# Altium schematic sheet AMS_Audio.SchDoc
size A
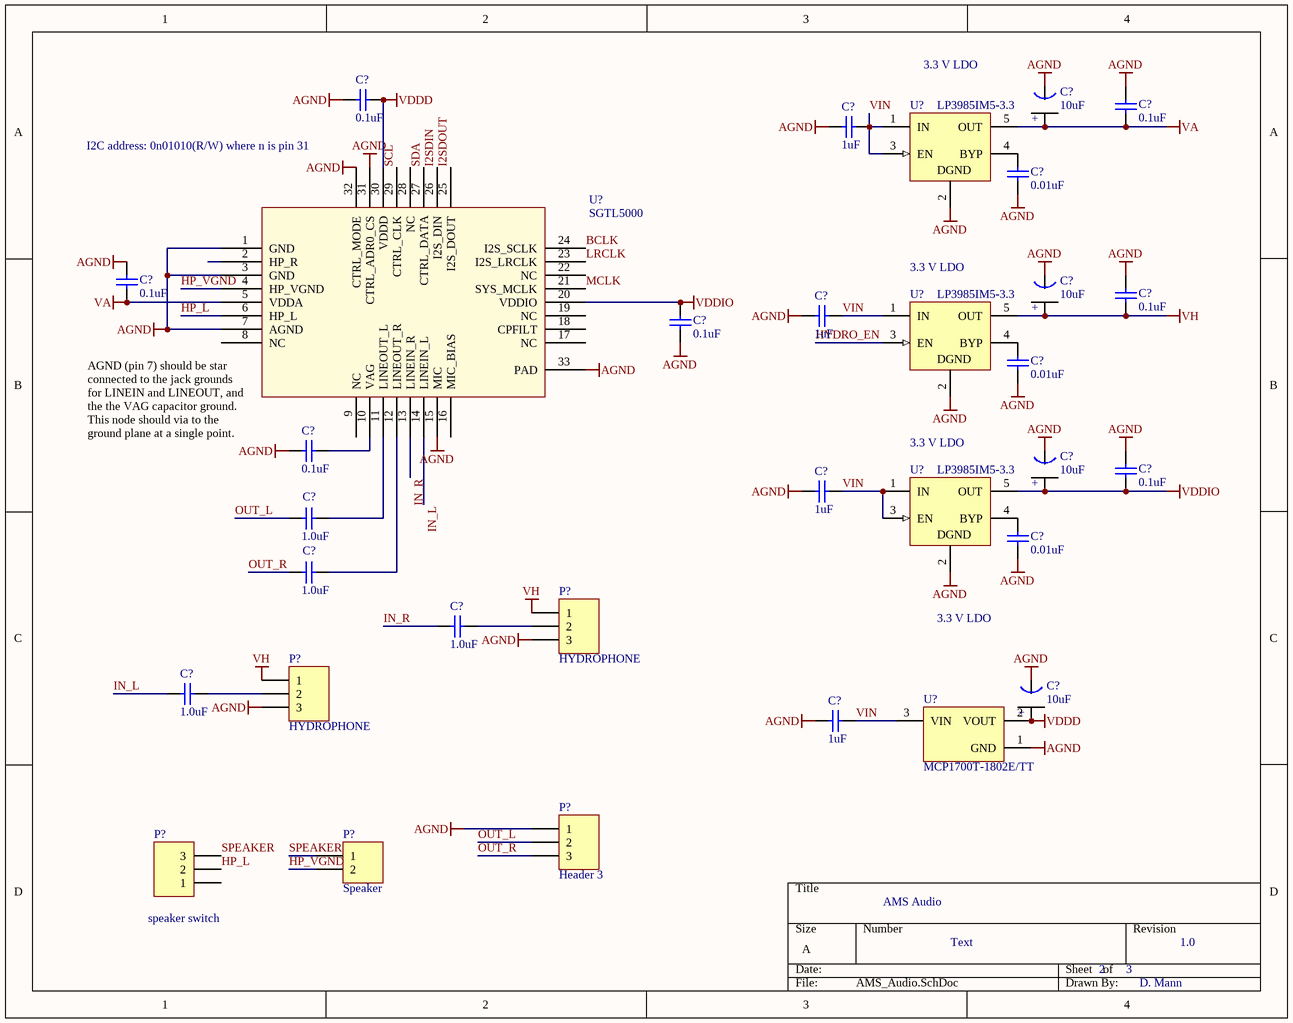
[diagram p0: AMS_Audio.SchDoc]

## Parts
(Parts that share a designator on the sheet are numbered #1, #2 ... from top to bottom, then left to right.)
C?#1  0.1uF  [0402]
C?#2  0.1uF  [0402]
C?#3  10uF  [Tant0805]
C?#4  1uF  [0402]
C?#5  0.01uF  [0402]
C?#6  0.1uF  [0402]
C?#7  0.1uF  [0402]
C?#8  10uF  [Tant0805]
C?#9  0.1uF  [0402]
C?#10  1uF  [0402]
C?#11  0.01uF  [0402]
C?#12  0.1uF  [0402]
C?#13  0.1uF  [0402]
C?#14  10uF  [Tant0805]
C?#15  1.0uF  [0402]
C?#16  1uF  [0402]
C?#17  0.01uF  [0402]
C?#18  1.0uF  [0402]
C?#19  1.0uF  [0402]
C?#20  1.0uF  [0402]
C?#21  10uF  [Tant0805]
C?#22  1uF  [0402]
P?#1  HYDROPHONE  [HDR1X3]
P?#2  HYDROPHONE  [HDR1X3]
P?#3  Header 3  [HDR1X3]
P?#4  Speaker  [HDR1X2]
P?#5  speaker switch  [HDR1X3]
U?#1  LP3985IM5-3.3  [MF05A_N]
U?#2  SGTL5000  [QFN32]
U?#3  LP3985IM5-3.3  [MF05A_N]
U?#4  LP3985IM5-3.3  [MF05A_N]
U?#5  MCP1700T-1802E/TT  [SOT-23-TT3_N]

## Nets
AGND: C?#1.2 C?#2.2 C?#3.1(GND) C?#4.2 C?#5.2 C?#6.2 C?#7.2 C?#8.1(GND) C?#9.2 C?#10.2 C?#11.2 C?#12.2 C?#13.2 C?#14.1(GND) C?#16.2 C?#17.2 C?#21.1(GND) C?#22.2 P?#1.3 P?#2.3 P?#3.1 U?#1.2(GND) U?#2.1(GND) U?#2.3(GND) U?#2.7(AGND) U?#2.15(MIC) U?#2.31(CTRL_ADR0_CS) U?#2.32(CTRL_MODE) U?#2.33(PAD) U?#3.2(GND) U?#4.2(GND) U?#5.1(GND)
VA: C?#2.1 C?#3.2(+) C?#6.1 U?#1.5(OUT) U?#2.5(VDDA)
VDDD: C?#1.1 C?#21.2(+) U?#2.30(VDDD) U?#5.2(VOUT)
VDDIO: C?#9.1 C?#13.1 C?#14.2(+) U?#2.20(VDDIO) U?#4.5(OUT)
VH: C?#7.1 C?#8.2(+) P?#1.1 P?#2.1 U?#3.5(OUT)
BCLK: U?#2.24(I2S_SCLK)
HP_L: P?#5.2 U?#2.6(HP_L)
HP_VGND: P?#4.2 U?#2.4(HP_VGND)
HYDRO_EN: U?#3.3(EN)
I2SDIN: U?#2.26(I2S_DIN)
I2SDOUT: U?#2.25(I2S_DOUT)
IN_L: C?#20.2 U?#2.14(LINEIN_L)
IN_R: C?#19.2 U?#2.13(LINEIN_R)
LRCLK: U?#2.23(I2S_LRCLK)
MCLK: U?#2.21(SYS_MCLK)
OUT_L: C?#15.1 P?#3.2
OUT_R: C?#18.1 P?#3.3
SCL: U?#2.29(CTRL_CLK)
SDA: U?#2.27(CTRL_DATA)
SPEAKER: P?#4.1 P?#5.3
VIN: C?#4.1 C?#10.1 C?#16.1 C?#22.1 U?#1.1(IN) U?#1.3(EN) U?#3.1(IN) U?#4.1(IN) U?#4.3(EN) U?#5.3(VIN)
NetC?#5_1: C?#5.1 U?#1.4(BYP)
NetC?#11_1: C?#11.1 U?#3.4(BYP)
NetC?#12_1: C?#12.1 U?#2.10(VAG)
NetC?#15_2: C?#15.2 U?#2.11(LINEOUT_L)
NetC?#17_1: C?#17.1 U?#4.4(BYP)
NetC?#18_2: C?#18.2 U?#2.12(LINEOUT_R)
NetC?#19_1: C?#19.1 P?#1.2
NetC?#20_1: C?#20.1 P?#2.2

Not connected (* = marked no-connect by the designer): P?#5 1; U?#2 2(HP_R) 8(NC) 9(NC) 16(MIC_BIAS) 17(NC) 18(CPFILT) 19(NC) 22(NC) 28(NC)

## Notes on the sheet
- 3.3 V LDO
- I2C address: 0n01010(R/W) where n is pin 31
- (near U?#3) 3.3 V LDO
- (near U?#2) AGND (pin 7) should be star connected to the jack grounds for LINEIN and LINEOUT, and the the VAG capacitor ground. This node should via to the ground plane at a single point.
- (near U?#4) 3.3 V LDO
- AMS Audio
- Text
- 2
- 3
- 1.0
- D. Mann
- (in symbol LP3985IM5-3.3) DGND

## Library data of the parts
C?#1 C?#2 C?#6 C?#7 C?#9 C?#12 C?#13 = C0402: Ceramic Chip Capacitor - Standard; Note: Footprint corresponds to dimensions for bulk cassette packaging. This case size has tightened tolerances.; Published: 17-Jul-2002; LatestRevisionDate: 19-Mar-2004; LatestRevisionNote: Silkscreen size reduced.; DatasheetDocument: Mar-2001; PackageDocument: Mar-2001; PackageReference: 0402; Publisher: Altium Limited; Code_JEITA: 0402; Code_IPC: 1005 [0402]; ComponentLink1Description: Manufacturer Link; ComponentLink1URL: http://www.kemet.com/; ComponentLink2Description: Datasheet; ComponentLink2URL: http://www.kemet.com/kemet/web/homepage/kechome.nsf/vapubfilesname/F3102TA.pdf/$file/F3102TA.pdf; Value: 0.1uF
C?#3 C?#8 C?#14 C?#21 = Tant0805: Value: 10uF
C?#4 C?#5 C?#10 C?#11 C?#15-C?#20 C?#22 = C0402: Ceramic Chip Capacitor - Standard; Note: Footprint corresponds to dimensions for bulk cassette packaging. This case size has tightened tolerances.; Value: 0.1uF; Published: 17-Jul-2002; LatestRevisionDate: 19-Mar-2004; LatestRevisionNote: Silkscreen size reduced.; DatasheetDocument: Mar-2001; PackageDocument: Mar-2001; PackageReference: 0402; Publisher: Altium Limited; Code_JEITA: 0402; Code_IPC: 1005 [0402]; ComponentLink1Description: Manufacturer Link; ComponentLink1URL: http://www.kemet.com/; ComponentLink2Description: Datasheet; ComponentLink2URL: http://www.kemet.com/kemet/web/homepage/kechome.nsf/vapubfilesname/F3102TA.pdf/$file/F3102TA.pdf
P?#1-P?#3 P?#5 = Header 3: Header, 3-Pin; LatestRevisionDate: 17-Jul-2002; LatestRevisionNote: Re-released for DXP Platform.; Publisher: Altium Limited
P?#4 = Header 2: Header, 2-Pin; LatestRevisionDate: 17-Jul-2002; LatestRevisionNote: Re-released for DXP Platform.; Publisher: Altium Limited
U?#1 U?#3 U?#4 = LP3985IM5-3.3: Micropower, 150mA Low-Noise Ultra Low-Dropout CMOS Voltage Regulator; Manufacturer: National Semiconductor; CompType: LDO IC; PackageTopMarking: LDQB*XTT; PowerWise: N; Published: 4-Dec-2008; DatasheetVersion: Aug-2005; PackageVersion: revD, Aug-2008; PackageReference: MF05A; Publisher: Altium Limited; PackageDescription: Molded SOT-23, .115 x .063 x .040 in Body, 5 Lead, .0375 in Pitch; PartNumber: LP3985IM5-3.3; RoHS: O; PinCount: 5; DigiKeyPartNumber: LP3985IM5-3.3CT-ND; ComponentLink1Description: LP3985 Datasheet; ComponentLink1URL: http://www.national.com/ds/LP/LP3985.pdf; ComponentLink2Description: LP3985 Web Page; ComponentLink2URL: http://www.national.com/pf/LP/LP3985.html; ComponentLink3Description: MF05A Package Page; ComponentLink3URL: http://www.national.com/packaging/folders/mf05a.html
U?#5 = MCP1700T-1802E/TT: Low Quiescent Current LDO, 3-Pin SOT-23, Extended Temperature, Tape and Reel; Manufacturer: Microchip; DatasheetVersion: revB, Feb-2007; PackageVersion: revBB, Aug-2009; PackageReference: SOT-23-TT3; PackageDescription: 3-Lead Plastic Small Outline Transistor (TT) [SOT-23]; Supplier 1: Digi-Key; Supplier Part Number 1: MCP1700T1802ETTTR-ND; Supplier 2: Digi-Key; Supplier Part Number 2: MCP1700T1802ETTCT-ND; Supplier 3: Digi-Key; Supplier Part Number 3: MCP1700T1802ETTDKR-ND; Supplier 4: Farnell; Supplier Part Number 4: 1296591RL; Supplier 5: Farnell; Supplier Part Number 5: 1296591; Supplier 6: Newark; Supplier Part Number 6: 84R5175; Supplier 7: Mouser; Supplier Part Number 7: 579-MCP1700T1802E/TT; Mounting Technology: Surface Mount; Code_IPC: SOT23-3; PartNumber: MCP1700T-1802E/TT; ComponentLink1Description: Manufacturer URL; ComponentLink1URL: http://www.microchip.com/; ComponentLink2Description: Datasheet; ComponentLink2URL: http://ww1.microchip.com/downloads/en/DeviceDoc/21826b.pdf; ComponentLink3Description: Package Specification; ComponentLink3URL: http://www.microchip.com/stellent/groups/techpub_sg/documents/packagingspec/en012702.pdf